# Altium schematic sheet emmc.SchDoc: Test
size A4; DrawnBy: Łukasz Przeniosło; Organization: Apptimia sp. z o.o.; Address1: Wojska Polskiego 184c/4; Address2: 71-256 Szczecin; Address3: www.apptimia.com; DocumentNumber: 8; Revision: 1; SheetNumber: 8; SheetTotal: 12
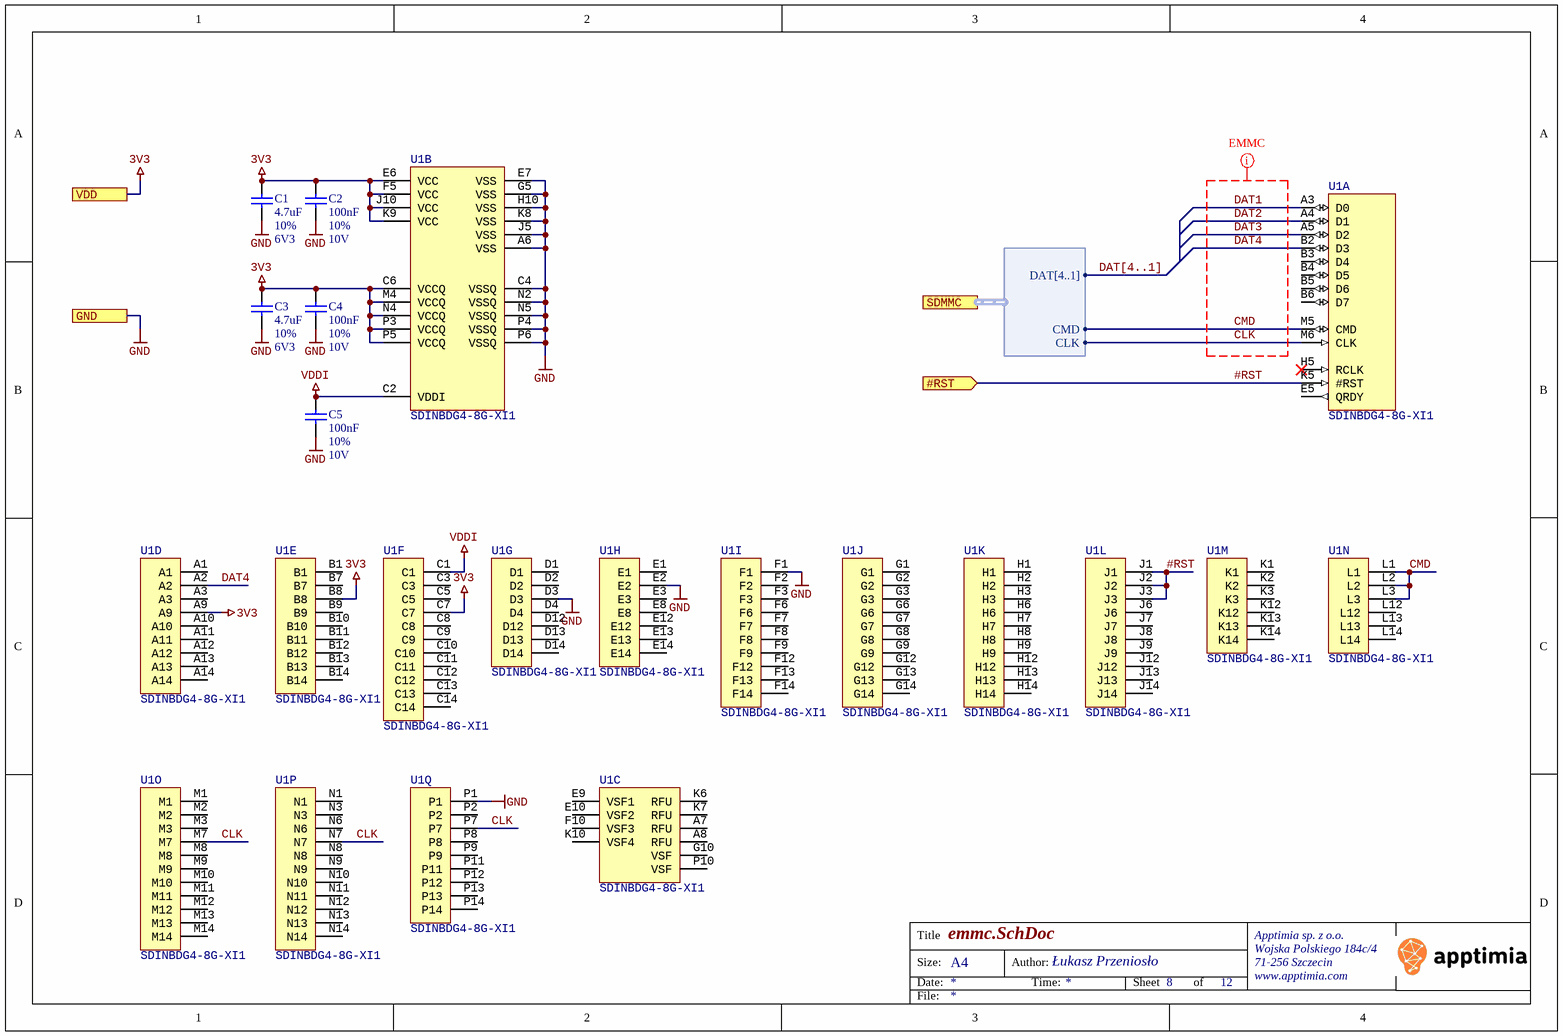
[diagram p0: emmc.SchDoc]

## Parts
C1  4.7uF  Tolerance: 10%  Voltage: 6V3  [CAPC1608N]
C2  100nF  Tolerance: 10%  Voltage: 10V  [CAPC1005N]
C3  4.7uF  Tolerance: 10%  Voltage: 6V3  [CAPC1608N]
C4  100nF  Tolerance: 10%  Voltage: 10V  [CAPC1005N]
C5  100nF  Tolerance: 10%  Voltage: 10V  [CAPC1005N]
U1  SDINBDG4-8G-XI1  [BGA153]  (parts A,B,C,D,E,F,G,H,I,J,K,L,M,N,O,P,Q of 17)

## Ports
#RST (in), GND, SDMMC (harness SDIO), VDD

## Harnesses
SDIO: DAT[4..1], CMD, CLK

## Nets
3V3: C1.2 C2.2 C3.2 C4.2 U1.A9 U1.B8 U1.C6(VCCQ) U1.C7 U1.E6(VCC) U1.F5(VCC) U1.J10(VCC) U1.K9(VCC) U1.M4(VCCQ) U1.N4(VCCQ) U1.P3(VCCQ) U1.P5(VCCQ) ; port VDD
GND: C1.1 C2.1 C3.1 C4.1 C5.1 U1.A6(VSS) U1.C4(VSSQ) U1.D3 U1.E2 U1.E7(VSS) U1.F1 U1.G5(VSS) U1.H10(VSS) U1.J5(VSS) U1.K8(VSS) U1.N2(VSSQ) U1.N5(VSSQ) U1.P1 U1.P4(VSSQ) U1.P6(VSSQ) ; port GND
VDDI: C5.2 U1.C1 U1.C2(VDDI)
#RST: U1.J1 U1.J2 U1.J3 U1.K5(#RST) ; port #RST
CLK: U1.M6(CLK) U1.M7 U1.N7 U1.P7 ; port SDMMC.CLK
CMD: U1.L1 U1.L2 U1.L3 U1.M5(CMD) ; port SDMMC.CMD
DAT1: U1.A3(D0)
DAT2: U1.A4(D1)
DAT3: U1.A5(D2)
DAT4: U1.A2 U1.B2(D3)

Not connected (* = marked no-connect by the designer): U1 A1 A7(RFU) A8(RFU) A10 A11 A12 A13 A14 B1 B3(D4) B4(D5) B5(D6) B6(D7) B7 B9 B10 B11 B12 B13 B14 C3 C5 C8 C9 C10 C11 C12 C13 C14 D1 D2 D4 D12 D13 D14 E1 E3 E5(QRDY) E8 E9(VSF1) E10(VSF2) E12 E13 E14 F2 F3 F6 F7 F8 F9 F10(VSF3) F12 F13 F14 G1 G2 G3 G6 G7 G8 G9 G10(VSF) G12 G13 G14 H1 H2 H3 H5(RCLK)* H6 H7 H8 H9 H12 H13 H14 J6 J7 J8 J9 J12 J13 J14 K1 K2 K3 K6(RFU) K7(RFU) K10(VSF4) K12 K13 K14 L12 L13 L14 M1 M2 M3 M8 M9 M10 M11 M12 M13 M14 N1 N3 N6 N8 N9 N10 N11 N12 N13 N14 P2 P8 P9 P10(VSF) P11 P12 P13 P14

## Buses and harness runs
bus DAT[4..1]

## Layout directives
rule Matched Net Lengths [Tolerance = 0.5mm]; rule Impedance Constraint [Min = 40.00    Max = 60.00    ]; net class EMMC_RULE: CLK, CMD, DAT1, DAT2, DAT3, DAT4

## Notes on the sheet
- Title
- Size:
- Date:
- A4
- Author:
- Time:
- Sheet
- of
- File:

## Library data of the parts
C1-C5 = Capacitor
  C1 C3: Value: 4.7uF
  C2 C4 C5: Value: 100nF
U1 = eMMC_5.x: eMMC 5.x chip; manid: SDINBDG4-8G-XI1